# Altium schematic sheet MC21R01_Onboard_temp_sensors.SchDoc: MC21R01 Top Level
size A3; Author: AMP; DrawnBy: AMP; Organization: Altium Limited; Address1: 3 Minna Close; Address2: Belrose; Address3: NSW 2085; Address4: Australia; DocumentNumber: 0; Revision: 1.0; SheetNumber: 0; SheetTotal: 0
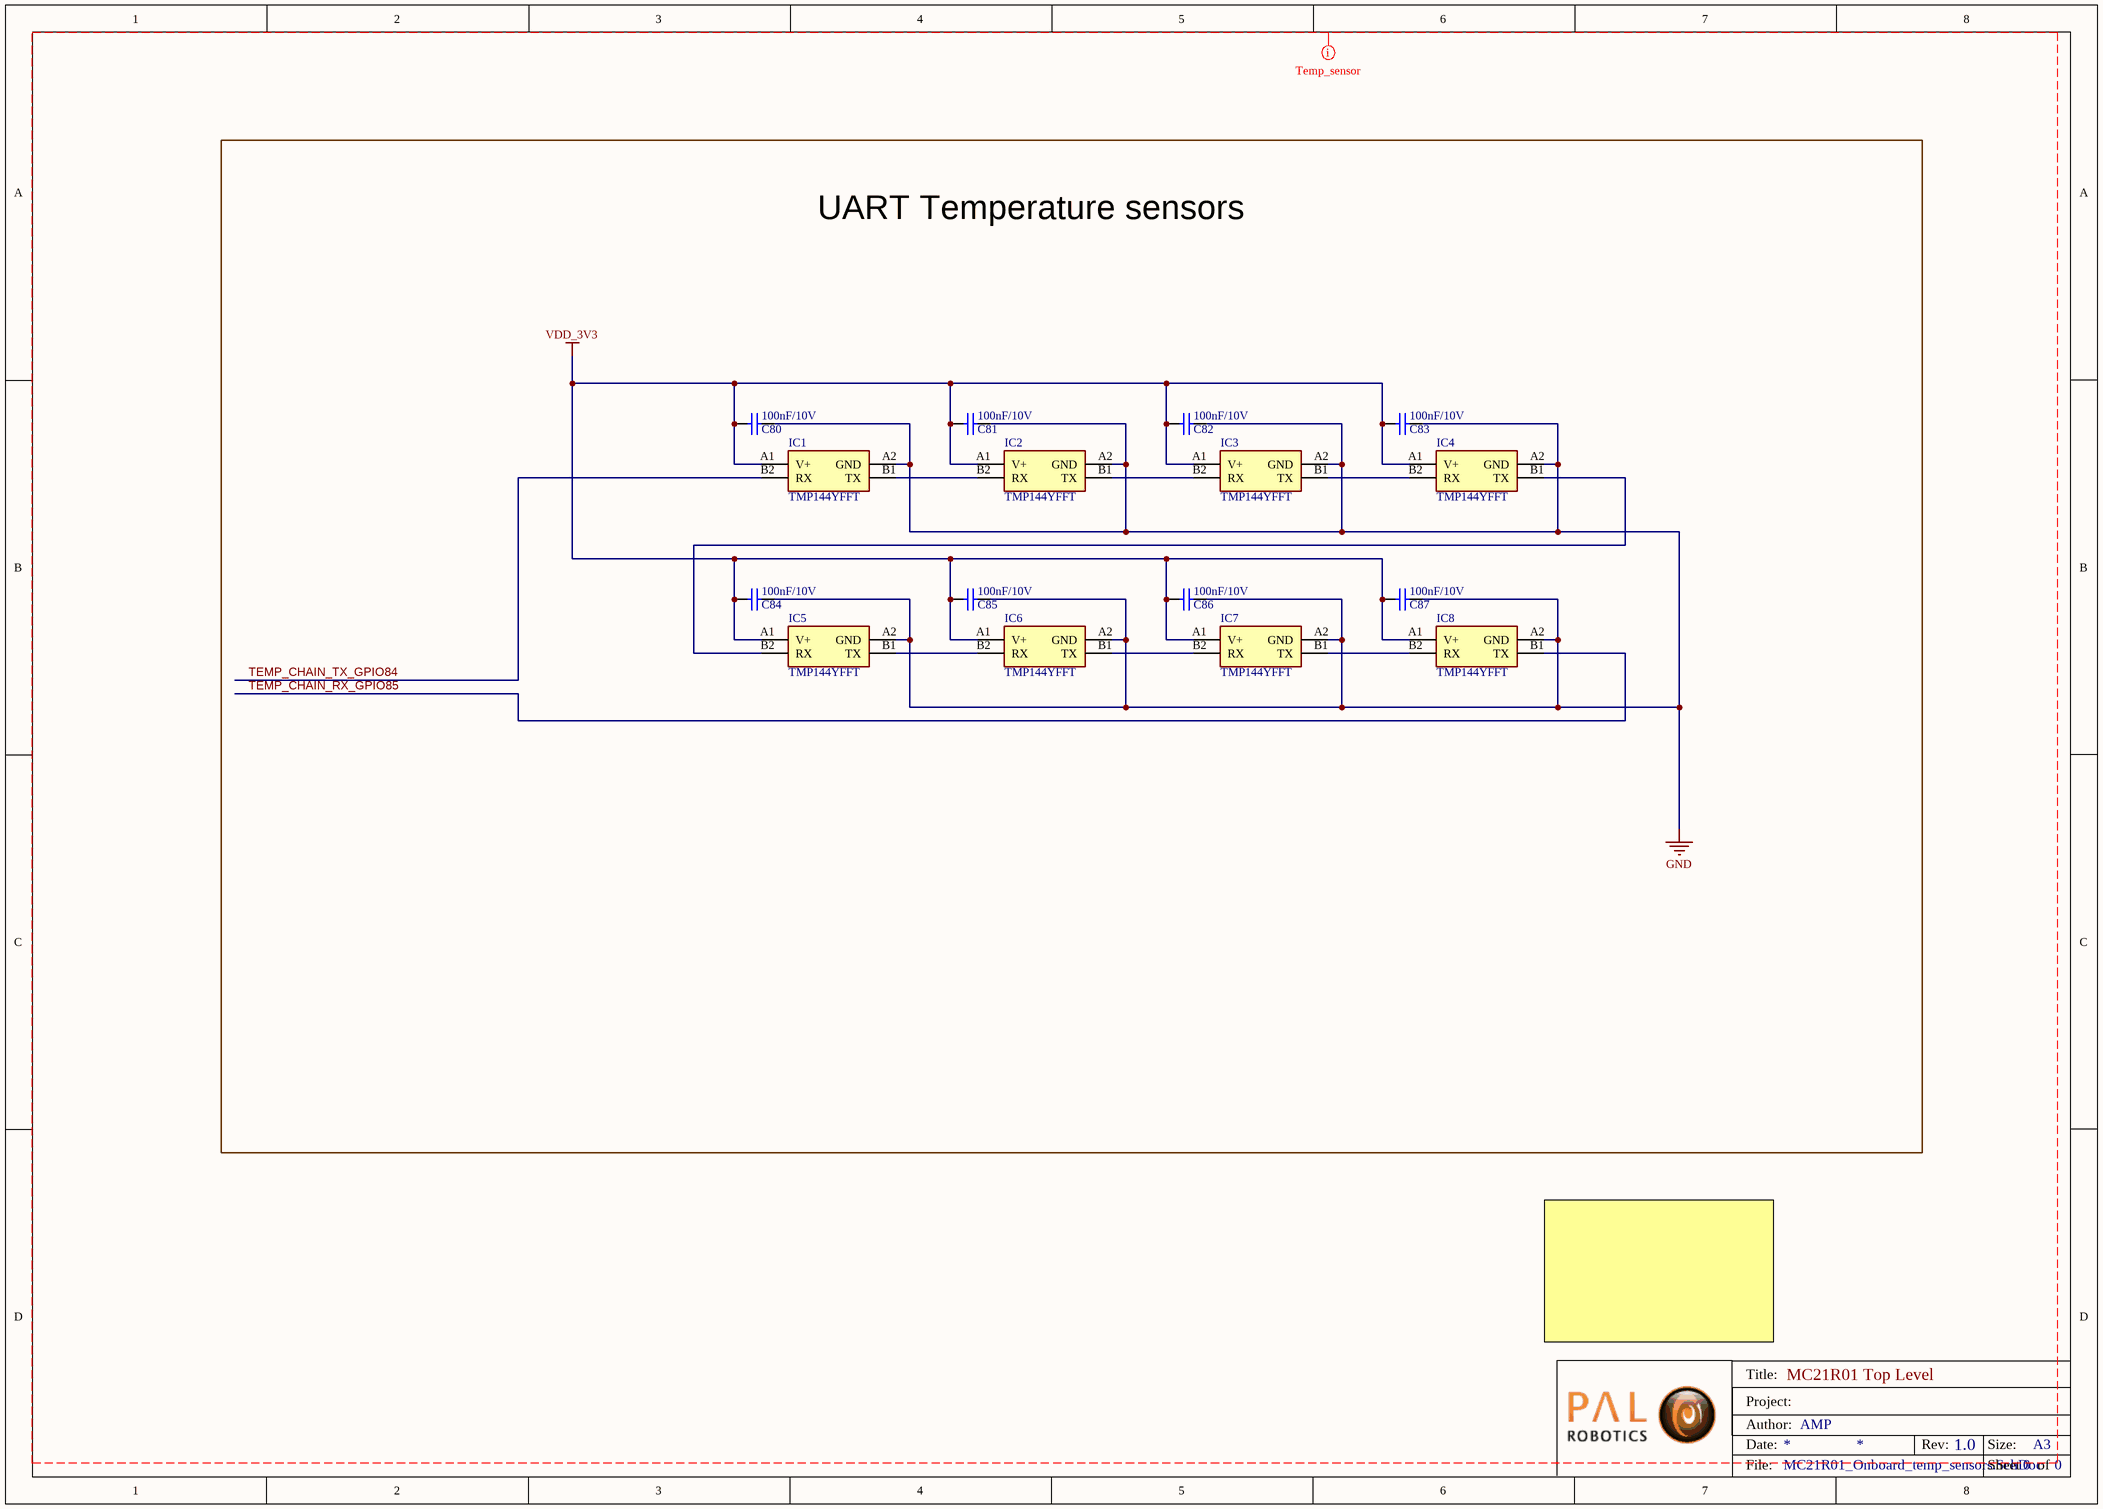
[diagram p0: MC21R01_Onboard_temp_sensors.SchDoc]

## Parts
C80  value 100nF/10V  [0402 SMD Capacitor]  (hidden comment: 100nF/10V 0402 20% X5R)
C81  value 100nF/10V  [0402 SMD Capacitor]  (hidden comment: 100nF/10V 0402 20% X5R)
C82  value 100nF/10V  [0402 SMD Capacitor]  (hidden comment: 100nF/10V 0402 20% X5R)
C83  value 100nF/10V  [0402 SMD Capacitor]  (hidden comment: 100nF/10V 0402 20% X5R)
C84  value 100nF/10V  [0402 SMD Capacitor]  (hidden comment: 100nF/10V 0402 20% X5R)
C85  value 100nF/10V  [0402 SMD Capacitor]  (hidden comment: 100nF/10V 0402 20% X5R)
C86  value 100nF/10V  [0402 SMD Capacitor]  (hidden comment: 100nF/10V 0402 20% X5R)
C87  value 100nF/10V  [0402 SMD Capacitor]  (hidden comment: 100nF/10V 0402 20% X5R)
IC1  TMP144YFFT  [TMP144YFFT]
IC2  TMP144YFFT  [TMP144YFFT]
IC3  TMP144YFFT  [TMP144YFFT]
IC4  TMP144YFFT  [TMP144YFFT]
IC5  TMP144YFFT  [TMP144YFFT]
IC6  TMP144YFFT  [TMP144YFFT]
IC7  TMP144YFFT  [TMP144YFFT]
IC8  TMP144YFFT  [TMP144YFFT]

## Blocks framed on the sheet
UART Temperature sensors: C80-C87 IC1-IC8

## Nets
GND: C80.2 C81.2 C82.2 C83.2 C84.2 C85.2 C86.2 C87.2 IC1.A2(GND) IC2.A2(GND) IC3.A2(GND) IC4.A2(GND) IC5.A2(GND) IC6.A2(GND) IC7.A2(GND) IC8.A2(GND)
VDD_3V3: C80.1 C81.1 C82.1 C83.1 C84.1 C85.1 C86.1 C87.1 IC1.A1(V+) IC2.A1(V+) IC3.A1(V+) IC4.A1(V+) IC5.A1(V+) IC6.A1(V+) IC7.A1(V+) IC8.A1(V+)
TEMP_CHAIN_RX_GPIO85: IC8.B1(TX)
TEMP_CHAIN_TX_GPIO84: IC1.B2(RX)
NetIC1_B1: IC1.B1(TX) IC2.B2(RX)
NetIC2_B1: IC2.B1(TX) IC3.B2(RX)
NetIC3_B1: IC3.B1(TX) IC4.B2(RX)
NetIC4_B1: IC4.B1(TX) IC5.B2(RX)
NetIC5_B1: IC5.B1(TX) IC6.B2(RX)
NetIC6_B1: IC6.B1(TX) IC7.B2(RX)
NetIC7_B1: IC7.B1(TX) IC8.B2(RX)

## Layout directives
net class Temp_sensor: GND, TEMP_CHAIN_RX_GPIO85, TEMP_CHAIN_TX_GPIO84, VDD_3V3

## Notes on the sheet
- Title:
- Date:
- Project:
- Author:
- Rev:
- Size:
- A3
- File:
- Sheet
- of

## Library data of the parts
C80-C87 = 100nF/10V 0402 20% X5R: 100nF/10V 0402 20% Tolerance X5R Multilayer Ceramic Chip Capacitor; Manufacturer 1: KEMET; Manufacturer Part Number 1: C0402C104M8PACTU; Supplier Part Number 1: 2810260; Supplier 1: Farnell
IC1-IC8 = TMP144YFFT: Integrated Circuit; Manufacturer_Name: Texas Instruments; Datasheet Link: http://www.ti.com/lit/ds/symlink/tmp144.pdf; Height: 0.625mm; Manufacturer_Part_Number: TMP144YFFT; Mouser Part Number: 595-TMP144YFFT; Mouser Price/Stock: https://www.mouser.com/Search/Refine.aspx?Keyword=595-TMP144YFFT